# Altium schematic sheet MotorsBoost.SchDoc
size A3; SheetNumber: 6; SheetTotal: 6
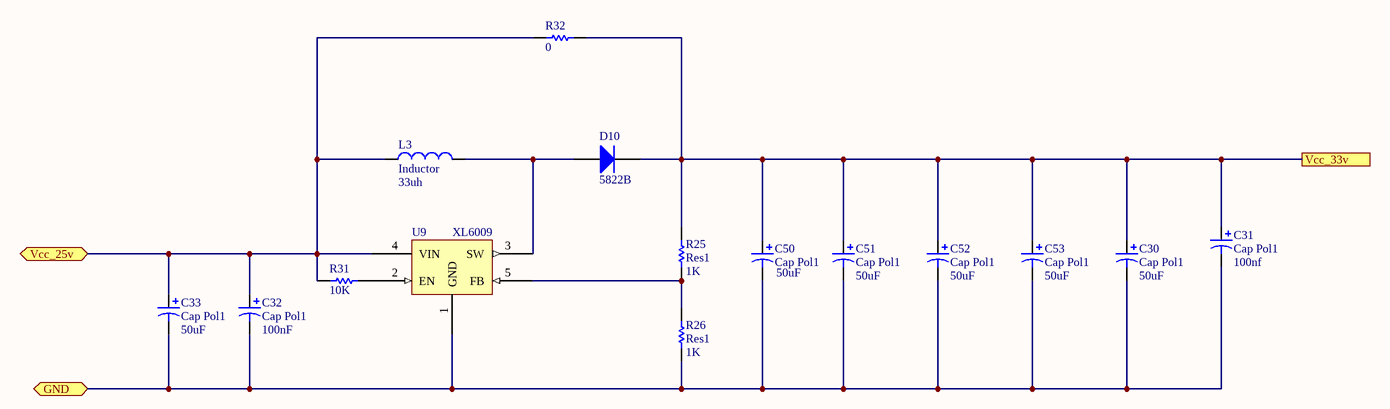
[diagram p0: MotorsBoost.SchDoc]

## Parts
C30  Cap Pol1  value 50uF  [Tantalum_9545]
C31  Cap Pol1  value 100nf  [1206_SMD]
C32  Cap Pol1  value 100nF  [1206_SMD]
C33  Cap Pol1  value 50uF  [Tantalum_9545]
C50  Cap Pol1  value 50uF  [Tantalum_9545]
C51  Cap Pol1  value 50uF  [Tantalum_9545]
C52  Cap Pol1  value 50uF  [Tantalum_9545]
C53  Cap Pol1  value 50uF  [Tantalum_9545]
D10  5822B  [SMB]
L3  Inductor  value 33uh  [inductor_12.3*12.3]
R25  Res1  value 1K  [0805_smd]
R26  Res1  value 1K  [0805_smd]
R31  10K  [0805_smd]
R32  0  [2010_smd]
U9  XL6009  [TO263-5L]

## Ports
GND (bidir), Vcc_25v (bidir), Vcc_33v

## Nets
GND: C30.2 C31.2 C32.2 C33.2 C50.2 C51.2 C52.2 C53.2 R26.1 U9.1(GND) ; port GND
Vcc_25v: C32.1 C33.1 L3.1 R31.1 R32.1 U9.4(VIN) ; port Vcc_25v
Vcc_33v: C30.1 C31.1 C50.1 C51.1 C52.1 C53.1 D10.2(K) R25.2 R32.2 ; port Vcc_33v
NetD10_1: D10.1(A) L3.2 U9.3(SW)
NetR25_1: R25.1 R26.2 U9.5(FB)
NetR31_2: R31.2 U9.2(EN)

## Library data of the parts
C30-C33 C50-C53 = Cap Pol1: Polarized Capacitor (Radial); Published: 8-Jun-2000; LatestRevisionDate: 17-Jul-2002; LatestRevisionNote: Re-released for DXP Platform.; PackageReference: RB7.6-15; Publisher: Altium Limited; PackageDescription: Polarized Capacitor (Radial); 2 Leads
D10 = Diode: Default Diode; Published: 8-Jun-2000; LatestRevisionDate: 17-Jul-2002; LatestRevisionNote: Re-released for DXP Platform.; PackageVersion: Sep-1996; PackageReference: SMC; Publisher: Altium Limited; PackageDescription: DO-214-AB/SMC; 2 C-Bend Leads; Body 7.9 x 5.9 mm, inc. leads (LxW); Code_JEDEC: DO-214-AB
L3 = Inductor: Code_IEC: 1005; Published: 8-Jun-2000; LatestRevisionDate: 29-May-2009; LatestRevisionNote: IPC-7351 Footprint Added.; PackageReference: 0402-A; Publisher: Altium Limited; PackageDescription: Chip Inductor; Code_JEITA: 0402
R25 R26 R31 R32 = Res1: Resistor; Published: 8-Jun-2000; LatestRevisionDate: 17-Jul-2002; LatestRevisionNote: Re-released for DXP Platform.; PackageReference: AXIAL-0.3; Publisher: Altium Limited; PackageDescription: Axial Device, Thru-Hole; 2 Leads; 0.3 in Pin Spacing
  R31: Value: 10K
  R32: Value: 0
U9 = XL6009: Voltage Booster